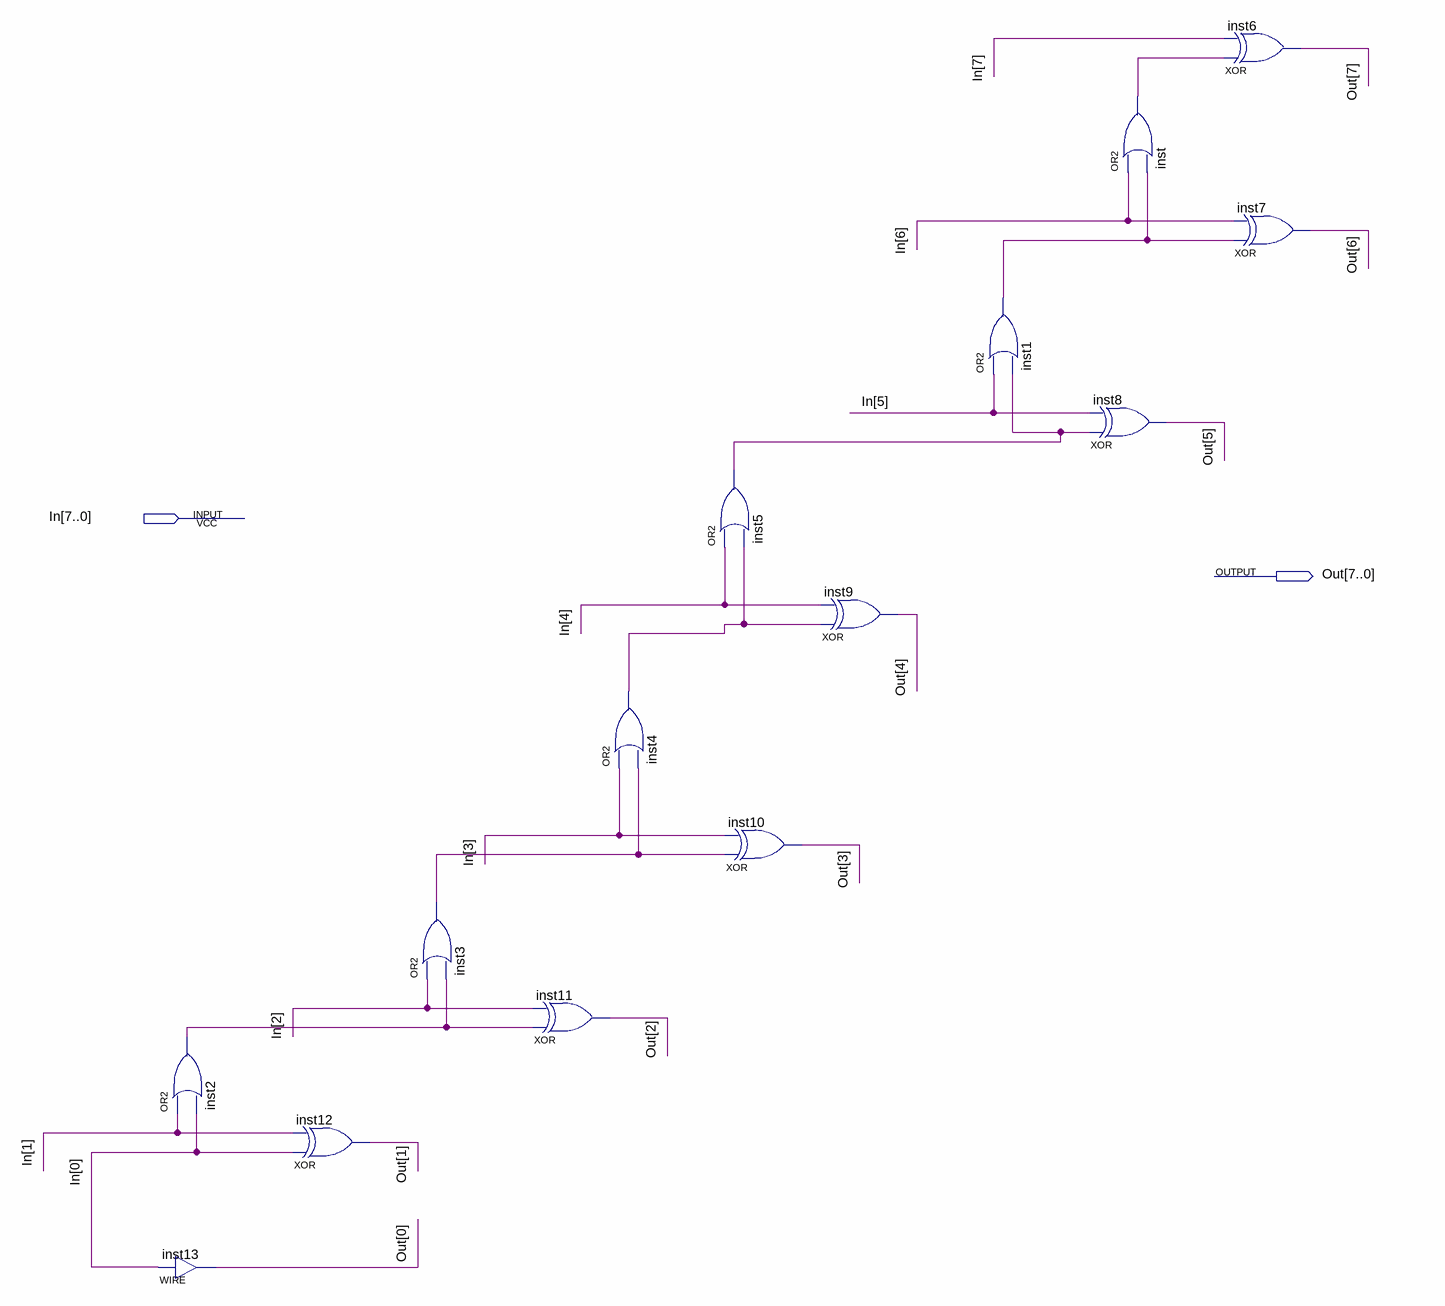
[diagram p0: schematic sheet]
// Quartus schematic C8.bdf as structural Verilog: 14 symbols, 2 pins
module C8 (
  input  [7:0] In,
  output [7:0] Out
);

  wire inst1_out, inst2_out, inst3_out, inst4_out, inst5_out, inst_out;

  or inst2 (inst2_out, In[1], In[0]);
  assign Out[0] = In[0];  // WIRE inst13
  xor inst12 (Out[1], In[0], In[1]);
  or inst3 (inst3_out, In[2], inst2_out);
  xor inst11 (Out[2], inst2_out, In[2]);
  or inst4 (inst4_out, In[3], inst3_out);
  or inst5 (inst5_out, In[4], inst4_out);
  xor inst10 (Out[3], inst3_out, In[3]);
  xor inst9 (Out[4], inst4_out, In[4]);
  or inst1 (inst1_out, In[5], inst5_out);
  or inst (inst_out, In[6], inst1_out);
  xor inst8 (Out[5], inst5_out, In[5]);
  xor inst6 (Out[7], inst_out, In[7]);
  xor inst7 (Out[6], inst1_out, In[6]);
endmodule
